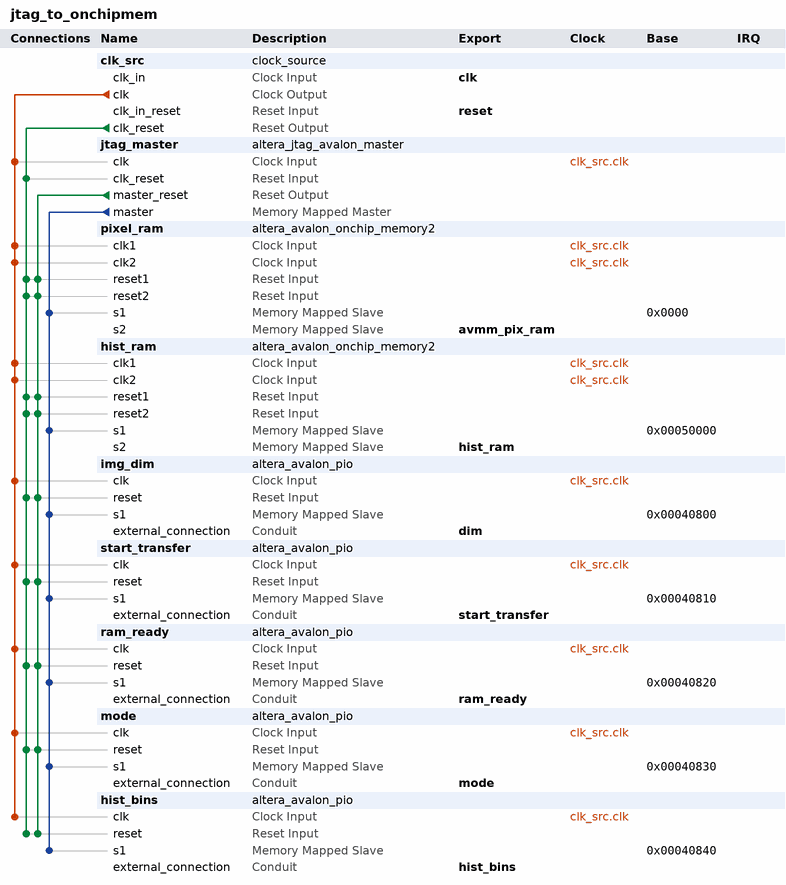
[diagram p0: system contents]
# Platform Designer (Qsys) system jtag_to_onchipmem, MAX 10 10M50DAF484C7G
# Parameters at their usual value, and those the tool derives, are not listed.
package require -exact qsys 19.1
create_system jtag_to_onchipmem
set_project_property DEVICE_FAMILY {MAX 10}
set_project_property DEVICE 10M50DAF484C7G

add_instance clk_src clock_source 19.1
set_instance_parameter_value clk_src clockFrequency 50000000

add_instance jtag_master altera_jtag_avalon_master 19.1

add_instance pixel_ram altera_avalon_onchip_memory2 19.1
set_instance_parameter_value pixel_ram blockType M9K
set_instance_parameter_value pixel_ram dataWidth 8
set_instance_parameter_value pixel_ram dualPort true
set_instance_parameter_value pixel_ram initMemContent false
set_instance_parameter_value pixel_ram initializationFileName onchip_mem.hex
set_instance_parameter_value pixel_ram memorySize 65536

add_instance hist_ram altera_avalon_onchip_memory2 19.1
set_instance_parameter_value hist_ram blockType M9K
set_instance_parameter_value hist_ram dataWidth 32
set_instance_parameter_value hist_ram dualPort true
set_instance_parameter_value hist_ram initMemContent false
set_instance_parameter_value hist_ram initializationFileName onchip_mem.hex
set_instance_parameter_value hist_ram memorySize 256

add_instance img_dim altera_avalon_pio 19.1
set_instance_parameter_value img_dim direction Output
set_instance_parameter_value img_dim width 32

add_instance start_transfer altera_avalon_pio 19.1
set_instance_parameter_value start_transfer direction Input
set_instance_parameter_value start_transfer width 32

add_instance ram_ready altera_avalon_pio 19.1
set_instance_parameter_value ram_ready direction Output
set_instance_parameter_value ram_ready width 32

add_instance mode altera_avalon_pio 19.1
set_instance_parameter_value mode direction Output
set_instance_parameter_value mode width 32

add_instance hist_bins altera_avalon_pio 19.1
set_instance_parameter_value hist_bins direction Output
set_instance_parameter_value hist_bins width 32

# connections
add_connection clk_src.clk hist_bins.clk clock
add_connection clk_src.clk hist_ram.clk1 clock
add_connection clk_src.clk hist_ram.clk2 clock
add_connection clk_src.clk img_dim.clk clock
add_connection clk_src.clk jtag_master.clk clock
add_connection clk_src.clk mode.clk clock
add_connection clk_src.clk pixel_ram.clk1 clock
add_connection clk_src.clk pixel_ram.clk2 clock
add_connection clk_src.clk ram_ready.clk clock
add_connection clk_src.clk start_transfer.clk clock
add_connection clk_src.clk_reset hist_bins.reset reset
add_connection clk_src.clk_reset hist_ram.reset1 reset
add_connection clk_src.clk_reset hist_ram.reset2 reset
add_connection clk_src.clk_reset img_dim.reset reset
add_connection clk_src.clk_reset jtag_master.clk_reset reset
add_connection clk_src.clk_reset mode.reset reset
add_connection clk_src.clk_reset pixel_ram.reset1 reset
add_connection clk_src.clk_reset pixel_ram.reset2 reset
add_connection clk_src.clk_reset ram_ready.reset reset
add_connection clk_src.clk_reset start_transfer.reset reset
add_connection jtag_master.master_reset hist_bins.reset reset
add_connection jtag_master.master_reset hist_ram.reset1 reset
add_connection jtag_master.master_reset hist_ram.reset2 reset
add_connection jtag_master.master_reset img_dim.reset reset
add_connection jtag_master.master_reset mode.reset reset
add_connection jtag_master.master_reset pixel_ram.reset1 reset
add_connection jtag_master.master_reset pixel_ram.reset2 reset
add_connection jtag_master.master_reset ram_ready.reset reset
add_connection jtag_master.master_reset start_transfer.reset reset
add_connection jtag_master.master hist_bins.s1 avalon
set_connection_parameter_value jtag_master.master/hist_bins.s1 baseAddress 0x00040840
add_connection jtag_master.master hist_ram.s1 avalon
set_connection_parameter_value jtag_master.master/hist_ram.s1 baseAddress 0x00050000
add_connection jtag_master.master img_dim.s1 avalon
set_connection_parameter_value jtag_master.master/img_dim.s1 baseAddress 0x00040800
add_connection jtag_master.master mode.s1 avalon
set_connection_parameter_value jtag_master.master/mode.s1 baseAddress 0x00040830
add_connection jtag_master.master pixel_ram.s1 avalon
set_connection_parameter_value jtag_master.master/pixel_ram.s1 baseAddress 0x0000
add_connection jtag_master.master ram_ready.s1 avalon
set_connection_parameter_value jtag_master.master/ram_ready.s1 baseAddress 0x00040820
add_connection jtag_master.master start_transfer.s1 avalon
set_connection_parameter_value jtag_master.master/start_transfer.s1 baseAddress 0x00040810

# exported interfaces
add_interface avmm_pix_ram avalon slave
set_interface_property avmm_pix_ram EXPORT_OF pixel_ram.s2
add_interface clk clock sink
set_interface_property clk EXPORT_OF clk_src.clk_in
add_interface dim conduit end
set_interface_property dim EXPORT_OF img_dim.external_connection
add_interface hist_bins conduit end
set_interface_property hist_bins EXPORT_OF hist_bins.external_connection
add_interface hist_ram avalon slave
set_interface_property hist_ram EXPORT_OF hist_ram.s2
add_interface mode conduit end
set_interface_property mode EXPORT_OF mode.external_connection
add_interface ram_ready conduit end
set_interface_property ram_ready EXPORT_OF ram_ready.external_connection
add_interface reset reset sink
set_interface_property reset EXPORT_OF clk_src.clk_in_reset
add_interface start_transfer conduit end
set_interface_property start_transfer EXPORT_OF start_transfer.external_connection

set_interconnect_requirement {$system} qsys_mm.clockCrossingAdapter HANDSHAKE
set_interconnect_requirement {$system} qsys_mm.enableEccProtection FALSE
set_interconnect_requirement {$system} qsys_mm.insertDefaultSlave FALSE
set_interconnect_requirement {$system} qsys_mm.maxAdditionalLatency 1

save_system jtag_to_onchipmem.qsys
